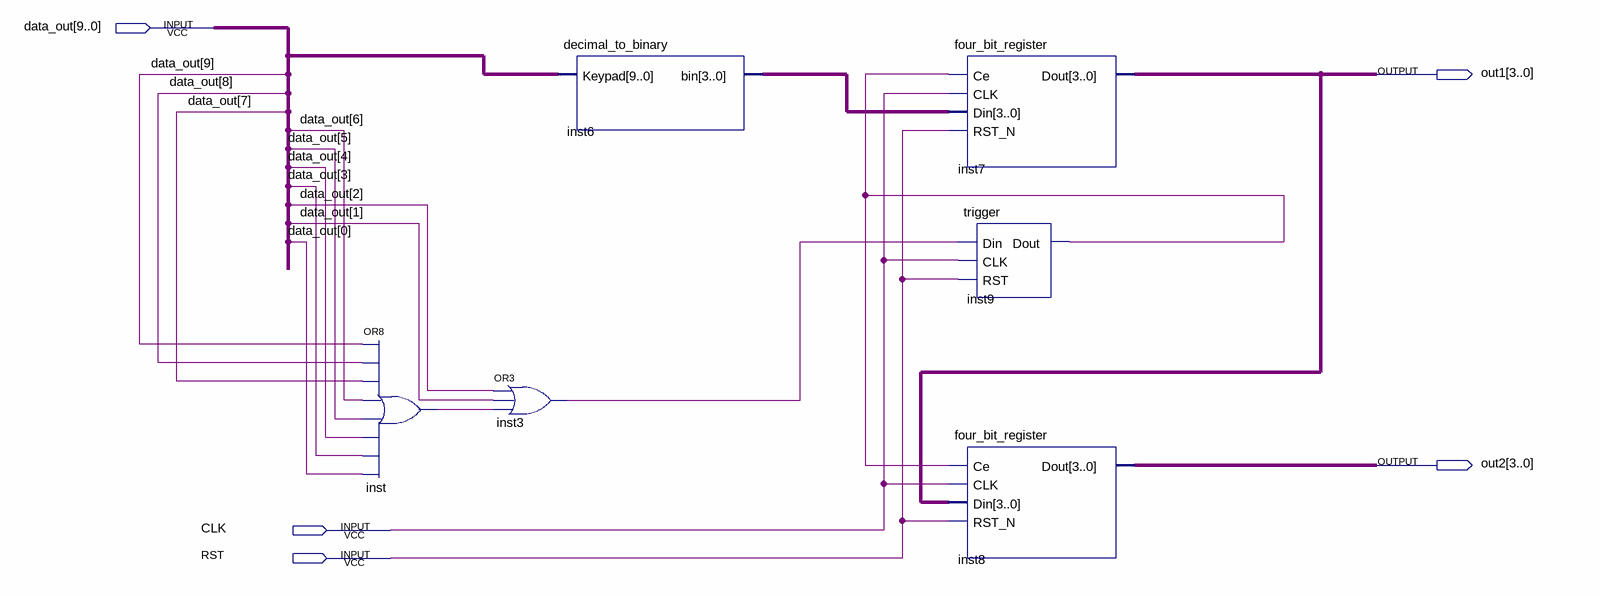
[diagram p0: schematic sheet]
// Quartus schematic week9_2.bdf as structural Verilog: 6 symbols, 5 pins
module week9_2 (
  input  [9:0] data_out,
  input  CLK,
  input  RST,
  output [3:0] out1,
  output [3:0] out2
);

  wire inst3_out, inst9_dout, inst_out;
  wire [3:0] inst6_bin;

  or inst (inst_out, data_out[9], data_out[8], data_out[7], data_out[6], data_out[5], data_out[4], data_out[3], data_out[0]);
  or inst3 (inst3_out, data_out[2], data_out[1], inst_out);
  decimal_to_binary inst6 (.Keypad(data_out), .bin(inst6_bin));
  four_bit_register inst7 (.Ce(inst9_dout), .CLK(CLK), .Din(inst6_bin), .RST_N(RST), .Dout(out1));
  trigger inst9 (.Din(inst3_out), .CLK(CLK), .RST(RST), .Dout(inst9_dout));
  four_bit_register inst8 (.Ce(inst9_dout), .CLK(CLK), .Din(out1), .RST_N(RST), .Dout(out2));
endmodule
